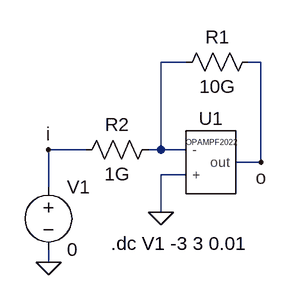
[diagram p0: schematic opamp_outswing.asc]
opamp_outswing.asc, the LTspice schematic file:
Version 4
SHEET 1 880 680
WIRE 160 0 128 0
WIRE 256 0 240 0
WIRE 32 112 -16 112
WIRE 128 112 128 0
WIRE 128 112 112 112
WIRE 160 112 128 112
WIRE 256 128 256 0
WIRE 256 128 224 128
WIRE 160 144 128 144
WIRE -16 160 -16 112
WIRE 128 192 128 144
WIRE -16 256 -16 240
FLAG -16 256 0
FLAG 128 192 0
FLAG 256 128 o
FLAG -16 112 i
SYMBOL res 256 -16 R90
WINDOW 0 0 56 VBottom 2
WINDOW 3 32 56 VTop 2
SYMATTR InstName R1
SYMATTR Value 10G
SYMBOL res 128 96 R90
WINDOW 0 0 56 VBottom 2
WINDOW 3 32 56 VTop 2
SYMATTR InstName R2
SYMATTR Value 1G
SYMBOL voltage -16 144 R0
WINDOW 123 0 0 Left 0
WINDOW 39 0 0 Left 0
SYMATTR InstName V1
SYMATTR Value 0
SYMBOL OPAMPF2022 192 128 R0
SYMATTR InstName U1
TEXT 64 232 Left 2 !.dc V1 -3 3 0.01

The netlist it stands for:
* opamp_outswing.asc
R1 o N001 10G
R2 N001 i 1G
V1 i 0 0
XU1 0 N001 o OPAMPF2022  ; pins + - out
.dc V1 -3 3 0.01
.lib C:\Users\ricig\Desktop\Lavoro\LTspice\schematics\FULL2024.cir
.backanno
.end